# Altium schematic sheet Main.SchDoc
size 381 x 508 mm; SheetNumber: 1; SheetTotal: 1
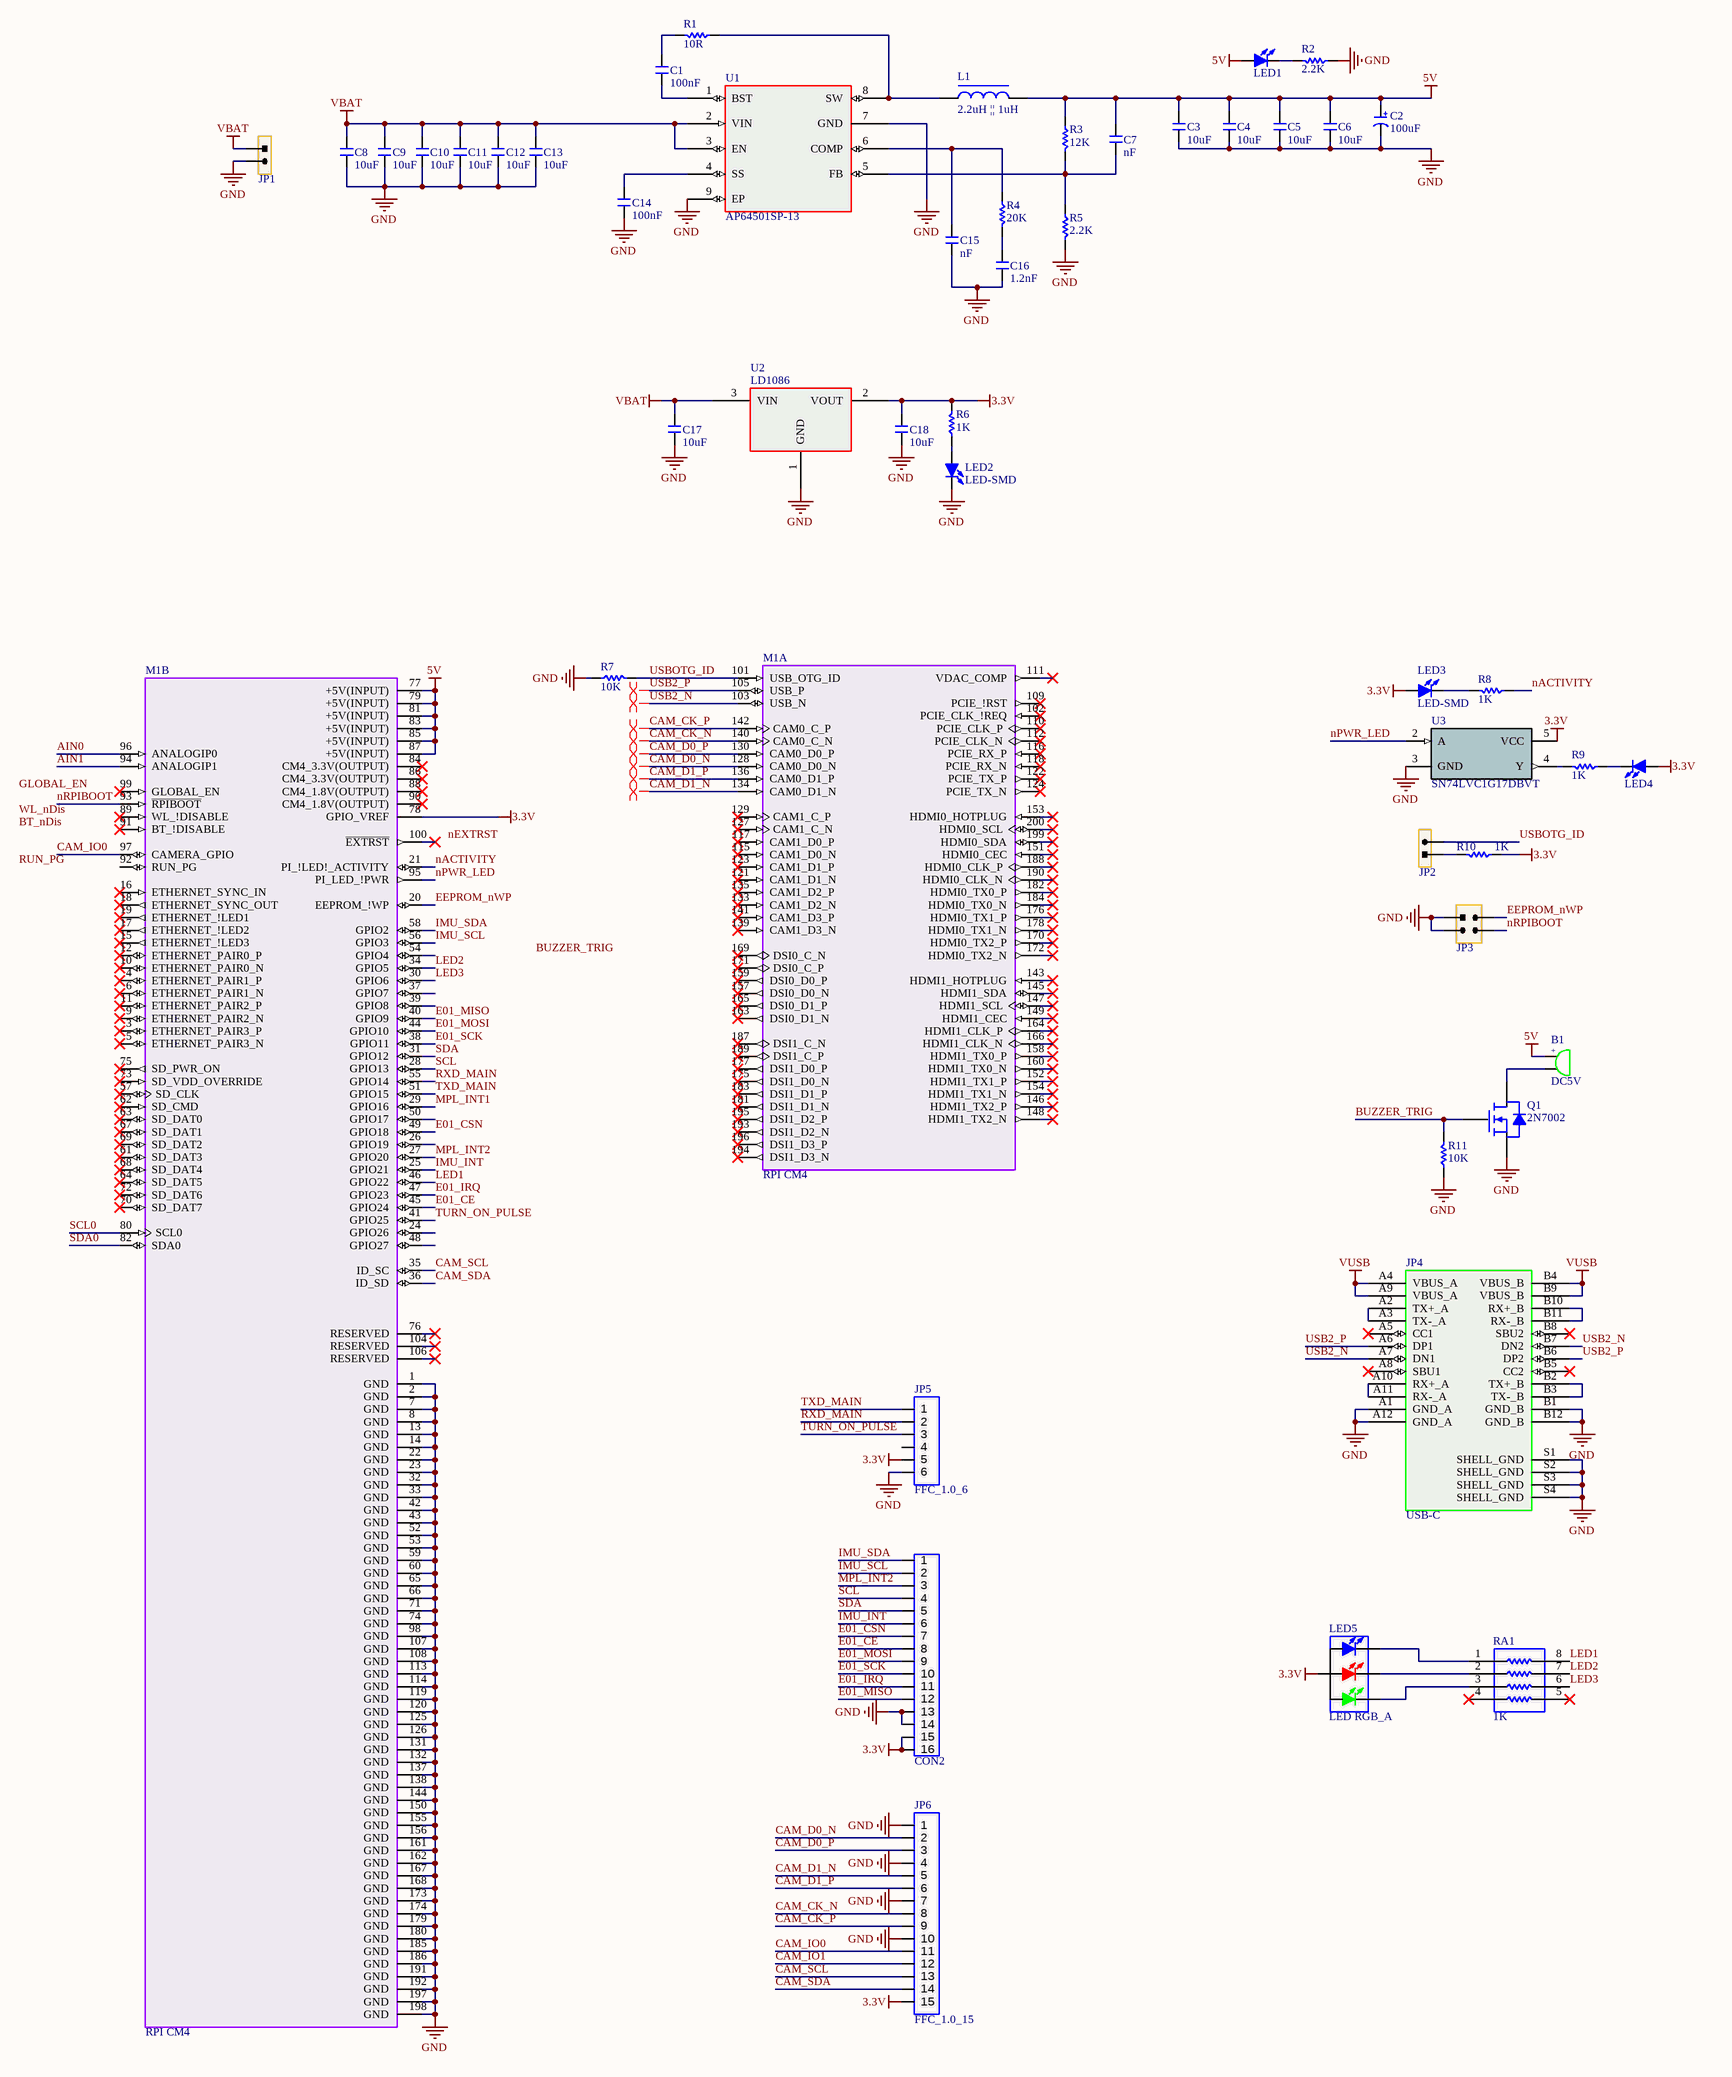
[diagram p0: Main.SchDoc]

## Parts
B1  DC5V  [Buzzer 6.5x12x8.5]
C1  100nF  [C 0603]
C2  100uF  [CD D(7343)]
C3  10uF  [C 0805]
C4  10uF  [C 0805]
C5  10uF  [C 0805]
C6  10uF  [C 0805]
C7  nF  [C 0603]
C8  10uF  [C 0805]
C9  10uF  [C 0805]
C10  10uF  [C 0805]
C11  10uF  [C 0805]
C12  10uF  [C 0805]
C13  10uF  [C 0805]
C14  100nF  [C 0603]
C15  nF  [C 0603]
C16  1.2nF  [C 0603]
C17  10uF  [C 0805]
C18  10uF  [C 0805]
CON2  FFC_0.5_16  [FFC_0.5_16]  (value not drawn)
JP1  HDR-1X2  [XH2.54-2P_H]  (value not drawn)
JP2  HDR-1X2  [HDR-1X2]  (value not drawn)
JP3  Header2X2  [HDR-2X2]  (value not drawn)
JP4  USB-C  [USB-C-RIGHT]
JP5  FFC_1.0_6  [FFC_1.0_6_BT]
JP6  FFC_1.0_15  [FFC_1.0_15_BT]
L1  2.2uH || 1uH  [CD53]
LED1  LED-SMD  [LED 0603R]  (value not drawn)
LED2  LED-SMD  [LED 0603R]
LED3  LED-SMD  [LED 0603Y]
LED4  LED-SMD  [LED 0603R]  (value not drawn)
LED5  LED RGB_A  [RGB-3535-A]
M1  RPI CM4  [CM4]  (parts A,B of 2)
Q1  2N7002  [SOT23-3L]
R1  10R  [R 0603]
R2  2.2K  [R 0603]
R3  12K  [R 0603]
R4  20K  [R 0603]
R5  2.2K  [R 0603]
R6  1K  [R 0603]
R7  10K  [R 0603]
R8  1K  [R 0603]
R9  1K  [R 0603]
R10  1K  [R 0603]
R11  10K  [R 0603]
RA1  1K  [RA1206 (4x0603)]
U1  AP64501SP-13  [SOP8_M-EP]
U2  LD1086  [TO252]
U3  SN74LVC1G17DBVT  [SOT23-5M]

## Nets
3.3V: C18.1 CON2.15 CON2.16 JP5.5 JP6.15 LED3.1(A) LED4.1(A) LED5.3(RED_A) M1.78(GPIO_VREF) R6.2 R10.1 U2.2(VOUT) U3.5(VCC)
5V: B1.A C2.1(A) C3.1 C4.1 C5.1 C6.1 C7.1 L1.2 LED1.1(A) M1.77(+5V(INPUT)) M1.79(+5V(INPUT)) M1.81(+5V(INPUT)) M1.83(+5V(INPUT)) M1.85(+5V(INPUT)) M1.87(+5V(INPUT)) R3.1
GND: C2.2(K) C3.2 C4.2 C5.2 C6.2 C8.2 C9.2 C10.2 C11.2 C12.2 C13.2 C14.2 C15.2 C16.2 C17.2 C18.2 CON2.13 CON2.14 JP1.2 JP3.1 JP3.3 JP4.A1(GND_A) JP4.A12(GND_A) JP4.B1(GND_B) JP4.B12(GND_B) JP4.S1(SHELL_GND) JP4.S2(SHELL_GND) JP4.S3(SHELL_GND) JP4.S4(SHELL_GND) JP5.6 JP6.1 JP6.4 JP6.7 JP6.10 LED2.2(K) M1.1(GND) M1.2(GND) M1.7(GND) M1.8(GND) M1.13(GND) M1.14(GND) M1.22(GND) M1.23(GND) M1.32(GND) M1.33(GND) M1.42(GND) M1.43(GND) M1.52(GND) M1.53(GND) M1.59(GND) M1.60(GND) M1.65(GND) M1.66(GND) M1.71(GND) M1.74(GND) M1.98(GND) M1.107(GND) M1.108(GND) M1.113(GND) M1.114(GND) M1.119(GND) M1.120(GND) M1.125(GND) M1.126(GND) M1.131(GND) M1.132(GND) M1.137(GND) M1.138(GND) M1.144(GND) M1.150(GND) M1.155(GND) M1.156(GND) M1.161(GND) M1.162(GND) M1.167(GND) M1.168(GND) M1.173(GND) M1.174(GND) M1.179(GND) M1.180(GND) M1.185(GND) M1.186(GND) M1.191(GND) M1.192(GND) M1.197(GND) M1.198(GND) Q1.2(S) R2.1 R5.2 R7.1 R11.1 U1.7(GND) U1.9(EP) U2.1(GND) U3.3(GND)
VBAT: C8.1 C9.1 C10.1 C11.1 C12.1 C13.1 C17.1 JP1.1 U1.2(VIN) U1.3(EN) U2.3(VIN)
VUSB: JP4.A4(VBUS_A) JP4.A9(VBUS_A) JP4.B4(VBUS_B) JP4.B9(VBUS_B)
AIN0: M1.96(ANALOGIP0)
AIN1: M1.94(ANALOGIP1)
BUZZER_TRIG: Q1.1(G) R11.2
CAM_CK_N: JP6.8 M1.140(CAM0_C_N)
CAM_CK_P: JP6.9 M1.142(CAM0_C_P)
CAM_D0_N: JP6.2 M1.128(CAM0_D0_N)
CAM_D0_P: JP6.3 M1.130(CAM0_D0_P)
CAM_D1_N: JP6.5 M1.134(CAM0_D1_N)
CAM_D1_P: JP6.6 M1.136(CAM0_D1_P)
CAM_IO0: JP6.11 M1.97(CAMERA_GPIO)
CAM_IO1: JP6.12
CAM_SCL: JP6.13 M1.35(ID_SC)
CAM_SDA: JP6.14 M1.36(ID_SD)
E01_CE: CON2.8 M1.45(GPIO24)
E01_CSN: CON2.7 M1.49(GPIO18)
E01_IRQ: CON2.11 M1.47(GPIO23)
E01_MISO: CON2.12 M1.40(GPIO9)
E01_MOSI: CON2.9 M1.44(GPIO10)
E01_SCK: CON2.10 M1.38(GPIO11)
EEPROM_nWP: JP3.2 M1.20(EEPROM_!WP)
IMU_INT: CON2.6 M1.25(GPIO21)
IMU_SCL: CON2.2 M1.56(GPIO3)
IMU_SDA: CON2.1 M1.58(GPIO2)
LED1: M1.46(GPIO22) RA1.8
LED2: M1.34(GPIO5) RA1.7
LED3: M1.30(GPIO6) RA1.6
MPL_INT1: M1.29(GPIO16)
MPL_INT2: CON2.3 M1.27(GPIO20)
nACTIVITY: M1.21(PI_!LED!_ACTIVITY) R8.1
nPWR_LED: M1.95(PI_LED_!PWR) U3.2(A)
nRPIBOOT: JP3.4 M1.93(~{RPIBOOT})
RXD_MAIN: JP5.2 M1.55(GPIO14)
SCL: CON2.4 M1.28(GPIO13)
SCL0: M1.80(SCL0)
SDA: CON2.5 M1.31(GPIO12)
SDA0: M1.82(SDA0)
TURN_ON_PULSE: JP5.3 M1.41(GPIO25)
TXD_MAIN: JP5.1 M1.51(GPIO15)
USB2_N: JP4.A7(DN1) JP4.B7(DN2) M1.103(USB_N)
USB2_P: JP4.A6(DP1) JP4.B6(DP2) M1.105(USB_P)
USBOTG_ID: JP2.2 M1.101(USB_OTG_ID) R7.2
NetB1_K: B1.K Q1.3(D)
NetC1_1: C1.1 R1.2
NetC1_2: C1.2 U1.1(BST)
NetC7_2: C7.2 R3.2 R5.1 U1.5(FB)
NetC14_1: C14.1 U1.4(SS)
NetC15_1: C15.1 R4.1 U1.6(COMP)
NetC16_1: C16.1 R4.2
NetJP2_1: JP2.1 R10.2
NetJP4_A2: JP4.A2(TX+_A) JP4.A3(TX-_A)
NetJP4_A10: JP4.A10(RX+_A) JP4.A11(RX-_A)
NetJP4_B2: JP4.B2(TX+_B) JP4.B3(TX-_B)
NetJP4_B10: JP4.B10(RX+_B) JP4.B11(RX-_B)
NetL1_1: L1.1 R1.1 U1.8(SW)
NetLED1_2: LED1.2(K) R2.2
NetLED2_1: LED2.1(A) R6.1
NetLED3_2: LED3.2(K) R8.2
NetLED4_2: LED4.2(K) R9.1
NetLED5_1: LED5.1(BULE_K) RA1.1
NetLED5_2: LED5.2(GREEN_K) RA1.3
NetLED5_4: LED5.4(RED_K) RA1.2
NetR9_2: R9.2 U3.4(Y)

Not connected (* = marked no-connect by the designer): JP4 A5(CC1)* A8(SBU1)* B5(CC2)* B8(SBU2)*; JP5 4; M1 3(ETHERNET_PAIR3_P)* 4(ETHERNET_PAIR1_P)* 5(ETHERNET_PAIR3_N)* 6(ETHERNET_PAIR1_N)* 9(ETHERNET_PAIR2_N)* 10(ETHERNET_PAIR0_N)* 11(ETHERNET_PAIR2_P)* 12(ETHERNET_PAIR0_P)* 15(ETHERNET_!LED3)* 16(ETHERNET_SYNC_IN)* 17(ETHERNET_!LED2)* 18(ETHERNET_SYNC_OUT)* 19(ETHERNET_!LED1)* 24(GPIO26) 26(GPIO19) 37(GPIO7) 39(GPIO8) 48(GPIO27) 50(GPIO17) 54(GPIO4) 57(SD_CLK)* 61(SD_DAT3)* 62(SD_CMD)* 63(SD_DAT0)* 64(SD_DAT5)* 67(SD_DAT1)* 68(SD_DAT4)* 69(SD_DAT2)* 70(SD_DAT7)* 72(SD_DAT6)* 73(SD_VDD_OVERRIDE)* 75(SD_PWR_ON)* 76(RESERVED)* 84(CM4_3.3V(OUTPUT))* 86(CM4_3.3V(OUTPUT))* 88(CM4_1.8V(OUTPUT))* 89(WL_!DISABLE)* 90(CM4_1.8V(OUTPUT))* 91(BT_!DISABLE)* 92(RUN_PG) 99(GLOBAL_EN)* 100(~{EXTRST})* 102(PCIE_CLK_!REQ)* 104(RESERVED)* 106(RESERVED)* 109(PCIE_!RST)* 110(PCIE_CLK_P)* 111(VDAC_COMP)* 112(PCIE_CLK_N)* 115(CAM1_D0_N)* 116(PCIE_RX_P)* 117(CAM1_D0_P)* 118(PCIE_RX_N)* 121(CAM1_D1_N)* 122(PCIE_TX_P)* 123(CAM1_D1_P)* 124(PCIE_TX_N)* 127(CAM1_C_N)* 129(CAM1_C_P)* 133(CAM1_D2_N)* 135(CAM1_D2_P)* 139(CAM1_D3_N)* 141(CAM1_D3_P)* 143(HDMI1_HOTPLUG)* 145(HDMI1_SDA)* 146(HDMI1_TX2_P)* 147(HDMI1_SCL)* 148(HDMI1_TX2_N)* 149(HDMI1_CEC)* 151(HDMI0_CEC)* 152(HDMI1_TX1_P)* 153(HDMI0_HOTPLUG)* 154(HDMI1_TX1_N)* 157(DSI0_D0_N)* 158(HDMI1_TX0_P)* 159(DSI0_D0_P)* 160(HDMI1_TX0_N)* 163(DSI0_D1_N)* 164(HDMI1_CLK_P)* 165(DSI0_D1_P)* 166(HDMI1_CLK_N)* 169(DSI0_C_N)* 170(HDMI0_TX2_P)* 171(DSI0_C_P)* 172(HDMI0_TX2_N)* 175(DSI1_D0_N)* 176(HDMI0_TX1_P)* 177(DSI1_D0_P)* 178(HDMI0_TX1_N)* 181(DSI1_D1_N)* 182(HDMI0_TX0_P)* 183(DSI1_D1_P)* 184(HDMI0_TX0_N)* 187(DSI1_C_N)* 188(HDMI0_CLK_P)* 189(DSI1_C_P)* 190(HDMI0_CLK_N)* 193(DSI1_D2_N)* 194(DSI1_D3_N)* 195(DSI1_D2_P)* 196(DSI1_D3_P)* 199(HDMI0_SDA)* 200(HDMI0_SCL)*; RA1 4* 5*

## Layout directives
differential pair: CAM_CK_N, CAM_CK_P, CAM_D0_N, CAM_D0_P, CAM_D1_N, CAM_D1_P, USB2_N, USB2_P

## Notes on the sheet
- Labels drawn without touching a wire or pin: BT_nDis, BUZZER_TRIG, GLOBAL_EN, nEXTRST, RUN_PG, WL_nDis
- (in symbol Buzzer) +
- (in symbol C-CD) +

## Library data of the parts
B1 = Buzzer: Active Piezo Electronic Buzzer Beep; BOM名称: 蜂鸣器; 版权归属: 源创客; 学习资源: www.ooocke.com
C1 C3-C18 = C: Non-polar patch capacitor; BOM名称: 无极性贴片电容; 版权归属: 源创客; 学习资源: www.ooocke.com
C2 = C-CD: Solid Tantalum Chip Capacitor, Standard T491 Series - Industrial Grade; Published: 17-Jul-2002; LatestRevisionDate: 19-Mar-2004; LatestRevisionNote: Silkscreen dimensions re-sized.; DatasheetDocument: Mar-2001; PackageDocument: Mar-2001; PackageReference: B; Publisher: Altium Limited; Code_JEITA: 3528-21; ComponentLink1Description: Manufacturer Link; ComponentLink1URL: http://www.kemet.com/; ComponentLink2Description: Datasheet; ComponentLink2URL: http://www.kemet.com/kemet/web/homepage/kechome.nsf/vapubfilesname/F3102TA.pdf/$file/F3102TA.pdf
CON2 = FFC_0.5_16: FFC
JP1 JP2 = Header 2: 2P Connector; BOM名称: 2P接插件; 版权归属: 源创客; 学习资源: www.ooocke.com
JP3 = Header 2X2: 2*2P Connector; BOM名称: 2*2P接插件; 版权归属: 源创客; 学习资源: www.ooocke.com
JP4 = USB-C-RIGHT
JP5 = FFC_1.0_6: FFC
JP6 = FFC_1.0_15: FFC
L1 = L-CD: Chip power inductor; BOM名称: 功率电感; 版权归属: 源创客; 学习资源: www.ooocke.com
LED1-LED4 = LED-SMD: Patch LED; BOM名称: 贴片LED; 版权归属: 源创客; 学习资源: www.ooocke.com
M1 = CM4
Q1 = 2N7002-SMD: N-Channel Enhancement Mode Field Effect Transistor
R1-R11 = R: Chip resistor; 版权归属: 源创客; BOM名称: Chip resistor; 学习资源: www.ooocke.com
RA1 = R-ARR: 4 way Chip Resistor Array
U2 = LD1086: Linear Voltage Regulator IC 1 Output 1.5A DPAK
U3 = SN74LVC1G17DBVT: Single 1.65-V to 5.5-V buffer with Schmitt-Trigger inputs